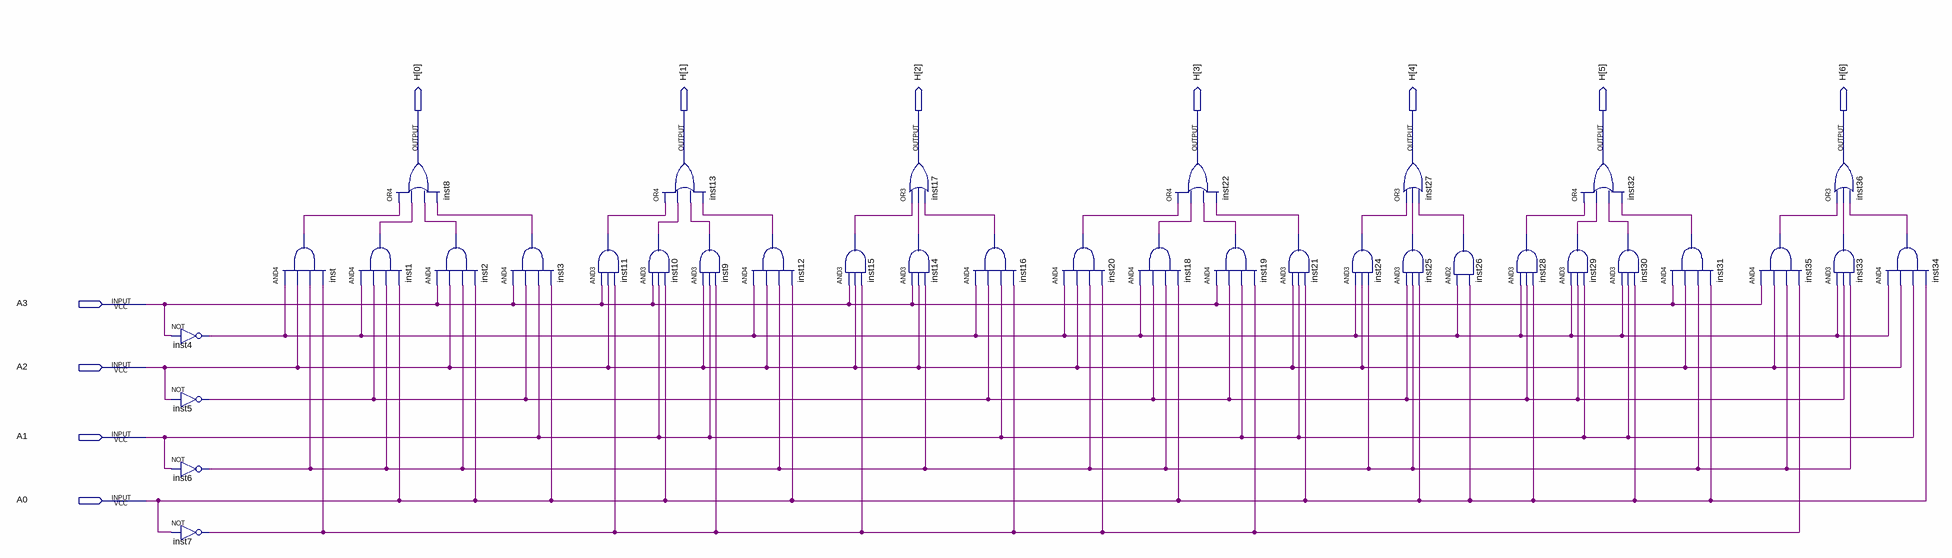
[diagram p0: schematic sheet]
// Quartus schematic lab_1.bdf as structural Verilog: 36 symbols, 11 pins
module lab_1 (
  input  A3,
  input  A2,
  input  A1,
  input  A0,
  output [6:0] H
);

  wire inst1_out, inst2_out, inst3_out, inst4_out, inst5_out, inst6_out, inst7_out, inst9_out, inst10_out,
       inst11_out, inst12_out, inst14_out, inst15_out, inst16_out, inst18_out, inst19_out, inst20_out,
       inst21_out, inst24_out, inst25_out, inst26_out, inst28_out, inst29_out, inst30_out, inst31_out,
       inst33_out, inst34_out, inst35_out, inst_out;

  not inst4 (inst4_out, A3);
  not inst5 (inst5_out, A2);
  not inst6 (inst6_out, A1);
  not inst7 (inst7_out, A0);
  and inst (inst_out, inst4_out, A2, inst6_out, inst7_out);
  and inst1 (inst1_out, inst4_out, inst5_out, inst6_out, A0);
  or inst8 (H[0], inst_out, inst1_out, inst2_out, inst3_out);
  and inst2 (inst2_out, A3, A2, inst6_out, A0);
  and inst3 (inst3_out, A3, inst5_out, A1, A0);
  and inst11 (inst11_out, A3, A2, inst7_out);
  or inst13 (H[1], inst11_out, inst10_out, inst9_out, inst12_out);
  and inst10 (inst10_out, A3, A1, A0);
  and inst9 (inst9_out, A2, A1, inst7_out);
  and inst12 (inst12_out, inst4_out, A2, inst6_out, A0);
  and inst15 (inst15_out, A3, A2, inst7_out);
  or inst17 (H[2], inst15_out, inst14_out, inst16_out);
  and inst14 (inst14_out, A3, A2, inst6_out);
  and inst16 (inst16_out, inst4_out, inst5_out, A1, inst7_out);
  and inst20 (inst20_out, inst4_out, A2, inst6_out, inst7_out);
  and inst18 (inst18_out, inst4_out, inst5_out, inst6_out, A0);
  or inst22 (H[3], inst20_out, inst18_out, inst19_out, inst21_out);
  and inst19 (inst19_out, A3, inst5_out, A1, inst7_out);
  and inst21 (inst21_out, A2, A1, A0);
  and inst24 (inst24_out, inst4_out, A2, inst6_out);
  or inst27 (H[4], inst24_out, inst25_out, inst26_out);
  and inst25 (inst25_out, inst5_out, inst6_out, A0);
  and inst26 (inst26_out, inst4_out, A0);
  and inst28 (inst28_out, inst4_out, inst5_out, A0);
  or inst32 (H[5], inst28_out, inst29_out, inst30_out, inst31_out);
  and inst29 (inst29_out, inst4_out, inst5_out, A1);
  and inst30 (inst30_out, inst4_out, A1, A0);
  and inst31 (inst31_out, A3, A2, inst6_out, A0);
  and inst35 (inst35_out, A3, A2, inst6_out, inst7_out);
  or inst36 (H[6], inst35_out, inst33_out, inst34_out);
  and inst33 (inst33_out, inst4_out, inst5_out, inst6_out);
  and inst34 (inst34_out, inst4_out, A2, A1, A0);
endmodule
